# EAGLE design Sicaklik_Kontrollu_Park_Sensoru (EAGLE 9.6.2)
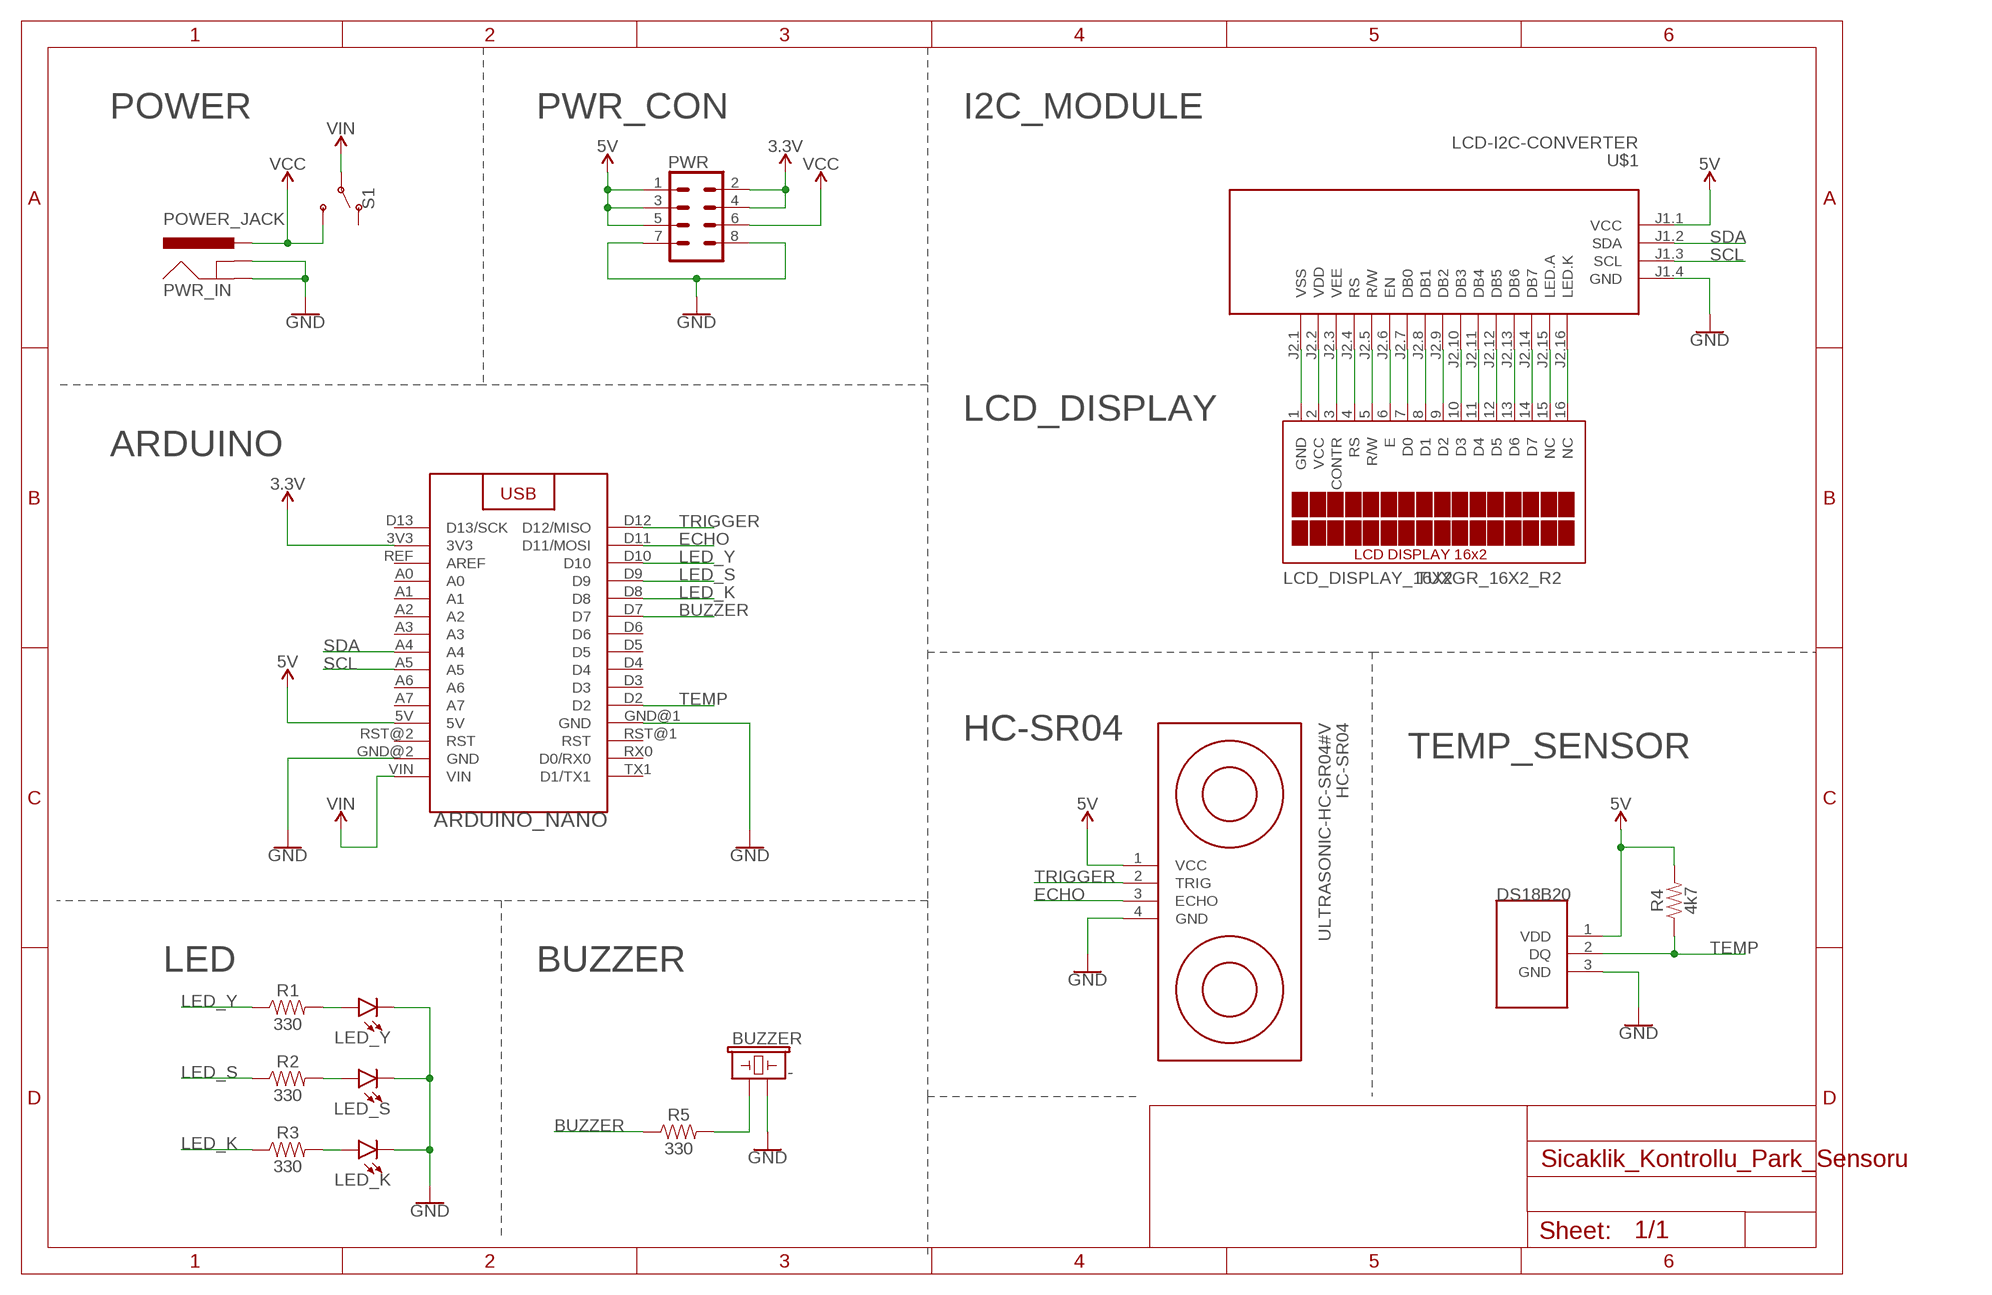
[diagram p0: schematic, sheet 1]

## Parts
ARDUINO_NANO  ARDUINO_NANO  [ARDUINO_NANO]
BUZZER  -  BUZZER-PTH  [BUZZER-12MM]
DS18B20  DS18B20  [TO-92]
HC-SR04  ULTRASONIC-HC-SR04#V  [ULTRASONIC-HC-SR04#V]
LCD_DISPLAY_16X2  TUXGR_16X2_R2  [TUXGR_16X2_R2]
LED_K  LED3MM  [LED_3MM]
LED_S  LED3MM  [LED_3MM]
LED_Y  LED3MM  [LED_3MM]
PWR  CONN_04X2  [2X4]
PWR_IN  POWER_JACK  [POWER_JACK_PTH]
R1  330  1KOHM-HORIZ-1/4W-5%  [AXIAL-0.3]
R2  330  1KOHM-HORIZ-1/4W-5%  [AXIAL-0.3]
R3  330  1KOHM-HORIZ-1/4W-5%  [AXIAL-0.3]
R4  4k7  1KOHM-HORIZ-1/4W-5%  [AXIAL-0.3]
R5  330  1KOHM-HORIZ-1/4W-5%  [AXIAL-0.3]
S1  SWITCH-SPDT-SMD-RIGHT-ANGLE  [SWITCH_SPST_SMD_A]
U$1  LCD-I2C-CONVERTER  [LCD-I2C-CONVERTER]

## Nets
3.3V: ARDUINO_NANO.3V3 PWR.2 PWR.4
5V: ARDUINO_NANO.5V DS18B20.1(VDD) HC-SR04.1(VCC) PWR.1 PWR.3 PWR.5 R4.P$2 U$1.J1.1(VCC)
BUZZER: ARDUINO_NANO.D7 R5.P$1
ECHO: ARDUINO_NANO.D11(D11/MOSI) HC-SR04.3(ECHO)
GND: ARDUINO_NANO.GND@1(GND) ARDUINO_NANO.GND@2(GND) BUZZER.- DS18B20.3(GND) HC-SR04.4(GND) LED_K.K(C) LED_S.K(C) LED_Y.K(C) PWR.7 PWR.8 PWR_IN.GND PWR_IN.GNDBREAK U$1.J1.4(GND)
LED_K: ARDUINO_NANO.D8 R3.P$1
LED_S: ARDUINO_NANO.D9 R2.P$1
LED_Y: ARDUINO_NANO.D10 R1.P$1
N$1: LCD_DISPLAY_16X2.16(NC) U$1.J2.16(LED.K)
N$2: LCD_DISPLAY_16X2.15(NC) U$1.J2.15(LED.A)
N$3: LCD_DISPLAY_16X2.14(D7) U$1.J2.14(DB7)
N$4: LCD_DISPLAY_16X2.13(D6) U$1.J2.13(DB6)
N$5: LCD_DISPLAY_16X2.12(D5) U$1.J2.12(DB5)
N$6: LCD_DISPLAY_16X2.11(D4) U$1.J2.11(DB4)
N$7: LCD_DISPLAY_16X2.10(D3) U$1.J2.10(DB3)
N$8: LCD_DISPLAY_16X2.9(D2) U$1.J2.9(DB2)
N$9: LCD_DISPLAY_16X2.8(D1) U$1.J2.8(DB1)
N$10: LCD_DISPLAY_16X2.7(D0) U$1.J2.7(DB0)
N$11: LCD_DISPLAY_16X2.6(E) U$1.J2.6(EN)
N$12: LCD_DISPLAY_16X2.5(R/W) U$1.J2.5(R/W)
N$13: LCD_DISPLAY_16X2.4(RS) U$1.J2.4(RS)
N$14: LCD_DISPLAY_16X2.3(CONTR) U$1.J2.3(VEE)
N$15: LCD_DISPLAY_16X2.2(VCC) U$1.J2.2(VDD)
N$16: LCD_DISPLAY_16X2.1(GND) U$1.J2.1(VSS)
N$18: BUZZER.+ R5.P$2
N$22: LED_Y.A R1.P$2
N$23: LED_S.A R2.P$2
N$24: LED_K.A R3.P$2
SCL: ARDUINO_NANO.A5 U$1.J1.3(SCL)
SDA: ARDUINO_NANO.A4 U$1.J1.2(SDA)
TEMP: ARDUINO_NANO.D2 DS18B20.2(DQ) R4.P$1
TRIGGER: ARDUINO_NANO.D12(D12/MISO) HC-SR04.2(TRIG)
VCC: PWR.6 PWR_IN.PWR S1.3(S)
VIN: ARDUINO_NANO.VIN S1.2(P)
Unconnected: ARDUINO_NANO.A0 ARDUINO_NANO.A1 ARDUINO_NANO.A2 ARDUINO_NANO.A3 ARDUINO_NANO.A6 ARDUINO_NANO.A7 ARDUINO_NANO.D3 ARDUINO_NANO.D4 ARDUINO_NANO.D5 ARDUINO_NANO.D6 ARDUINO_NANO.D13(D13/SCK) ARDUINO_NANO.REF(AREF) ARDUINO_NANO.RST@1(RST) ARDUINO_NANO.RST@2(RST) ARDUINO_NANO.RX0(D0/RX0) ARDUINO_NANO.TX1(D1/TX1) S1.1(O)

## Notes on the sheet
- POWER | PWR_CON | I2C_MODULE
- LCD_DISPLAY
- ARDUINO
- HC-SR04
- TEMP_SENSOR
- LED | BUZZER

## Library data of the parts
ARDUINO_NANO = Arikaya_lib:ARDUINO_NANO: Arduino Nano Devices
BUZZER = SparkFun-Electromechanical:BUZZER: Buzzer Small round buzzers that operate around the audible 2kHz range. You can use these as speakers to create simple music or user interfaces. Variant Overview: PTH - Mini Speaker - PC Mount 12mm 2.048kHz <https://www.sparkfun.com/products/7950> PTH_KIT - Mini Speaker - PC Mount 12mm 2.048kHz <https://www.sparkfun.com/products/7950> KIT simplifies soldering by adding stop mask to one side of the pads. PTH_NO_SILK - Mini Speaker - PC Mount 12mm 2.048kHz <https://www.sparkfun.com/products/7950> No silkscreen indicator of buzzer outline. PTH_KIT_NO_SILK - Mini Speaker - PC Mount 12mm 2.048kHz <https://www.sparkfun.com/products/7950> KIT package w/o silkscreen SMD - Buzzer Audio Magnetic (CCV-084B16) SMD buzzer used on, e.g. the LilyPad Buzzer <https://www.sparkfun.com/products/8463> and RFID USB Reader <https://www.sparkfun.com/products/9963>. SMD_KIT - Buzzer Audio Magnetic (CCV-084B16) SMD Buzzer with elongated pins to make soldering easier. Used on the SparkFun Simon Says - Surface Mount Soldering Kit <https://www.sparkfun.com/products/10935>.; PROD_ID: COMP-08253; SF_SKU: COM-07950
DS18B20 = Arikaya_lib:DS18B20
HC-SR04 = diy-modules:ULTRASONIC-HC-SR04: Ultrasonic Ranging Module HC-SR04 More details available here: http://randomnerdtutorials.com/complete-guide-for-ultrasonic-sensor-hc-sr04/ Click here to find device on ebay.com <http://www.ebay.com/sch/hc+sr04+ultrasonic>
LCD_DISPLAY_16X2 = display-lcd:TUXGR_16X2_R2: Tuxgraphics LCD display 16x2 characters reflective, without background light Source: tuxgr_12x2_r2.pdf; OC_FARNELL: unknown; OC_NEWARK: unknown
LED_K LED_S LED_Y = SparkFun-LED:LED: LED (Generic) Standard schematic elements and footprints for 5mm, 3mm, 1206, and 0603 sized LEDs. Generic LEDs with no color specified.; PROD_ID: DIO-08794
PWR = SparkFun-Connectors:CONN_04X2: Multi connection point. Often used as Generic Header-pin footprint for 0.1 inch spaced/style header connections On any of the 0.1 inch spaced packages, you can populate with these: Break Away Headers - Straight <https://www.sparkfun.com/products/116> (PRT-00116) Break Away Male Headers - Right Angle <https://www.sparkfun.com/products/553> (PRT-00553) Female Headers <https://www.sparkfun.com/products/115> (PRT-00115) Break Away Headers - Machine Pin <https://www.sparkfun.com/products/117> (PRT-00117) Break Away Female Headers - Swiss Machine Pin <https://www.sparkfun.com/products/743> (PRT-00743)
PWR_IN = SparkFun-Connectors:POWER_JACK: Power Jack Connector This is the standard 5.5mm barrel jack for power. The PTH is the most common, proven, reliable, footprint. The Slot footprint only works if the mill layer is transmitted to the PCB fab house so be warned. Here are the connectors we sell at SparkFun: DC Barrel Power Jack/Connector <https://www.sparkfun.com/products/119> (PRT-00119) DC Barrel Power Jack/Connector (SMD) <https://www.sparkfun.com/products/12748> (PRT-12748) DC Barrel Jack Adapter - Breadboard Compatible <https://www.sparkfun.com/products/10811> (PRT-10811) It is used on this SparkFun product (and many, many others): SparkFun RedBoard - Programmed with Arduino <https://www.sparkfun.com/products/12757> (DEV-12757) Also, if you need a mating power supply or connector, please check these out: Wall Adapter Power Supply - 9VDC 650mA <https://www.sparkfun.com/products/298> (TOL-00298) DC Barrel Jack Adapter - Male <https://www.sparkfun.com/products/10287> (PRT-10287); PROD_ID: CONN-08197
R1-R5 = SparkFun-Resistors:1KOHM: 1kΩ resistor A resistor is a passive two-terminal electrical component that implements electrical resistance as a circuit element. Resistors act to reduce current flow, and, at the same time, act to lower voltage levels within circuits. - Wikipedia; PROD_ID: RES-08380; VALUE: 1k
S1 = SparkFun-Switches:SWITCH-SPDT: Single Pole, Double Throw (SPDT) Switch Single-pole, double-throw (SPDT) switch. Variant Overview SMD-AYZ0202 Surface Mount DPDT Switch <https://www.sparkfun.com/products/597> (COM-00597) Used on e.g. LilyPad Arduino USB - ATmega32U4 Board <https://www.sparkfun.com/products/12049> PTH-11.6X4.0MM SPDT Mini Power Switch <https://www.sparkfun.com/products/102> (COM-00102) Used on e.g. SparkFun Simon Says - Through-Hole Soldering Kit <https://www.sparkfun.com/products/10547> (KIT-10547) PTH-11.6X4.0MM-KIT KIT version of SPDT Mini Power Switch - Simplifies soldering by removing tStop of switch pins - only one side can be soldered. PTH-11.6X4.0MM-LOCK LOCK version of SPDT Mini Power Switch - Offset pins hold switch in place for easier soldering. SMD-RIGHT-ANGLE Surface Mount Right Angle Switch <https://www.sparkfun.com/products/10860> (COM-10860) Used on e.g. SparkFun ESP8266 Thing <https://www.sparkfun.com/products/13231>; PROD_ID: SWCH-10651; SF_SKU: COM-10860
U$1 = diy-modules:LCD-I2C-CONVERTER: I2C Bus to 4-Bit Parallel LCD Interface with LED backlight driver

## Board
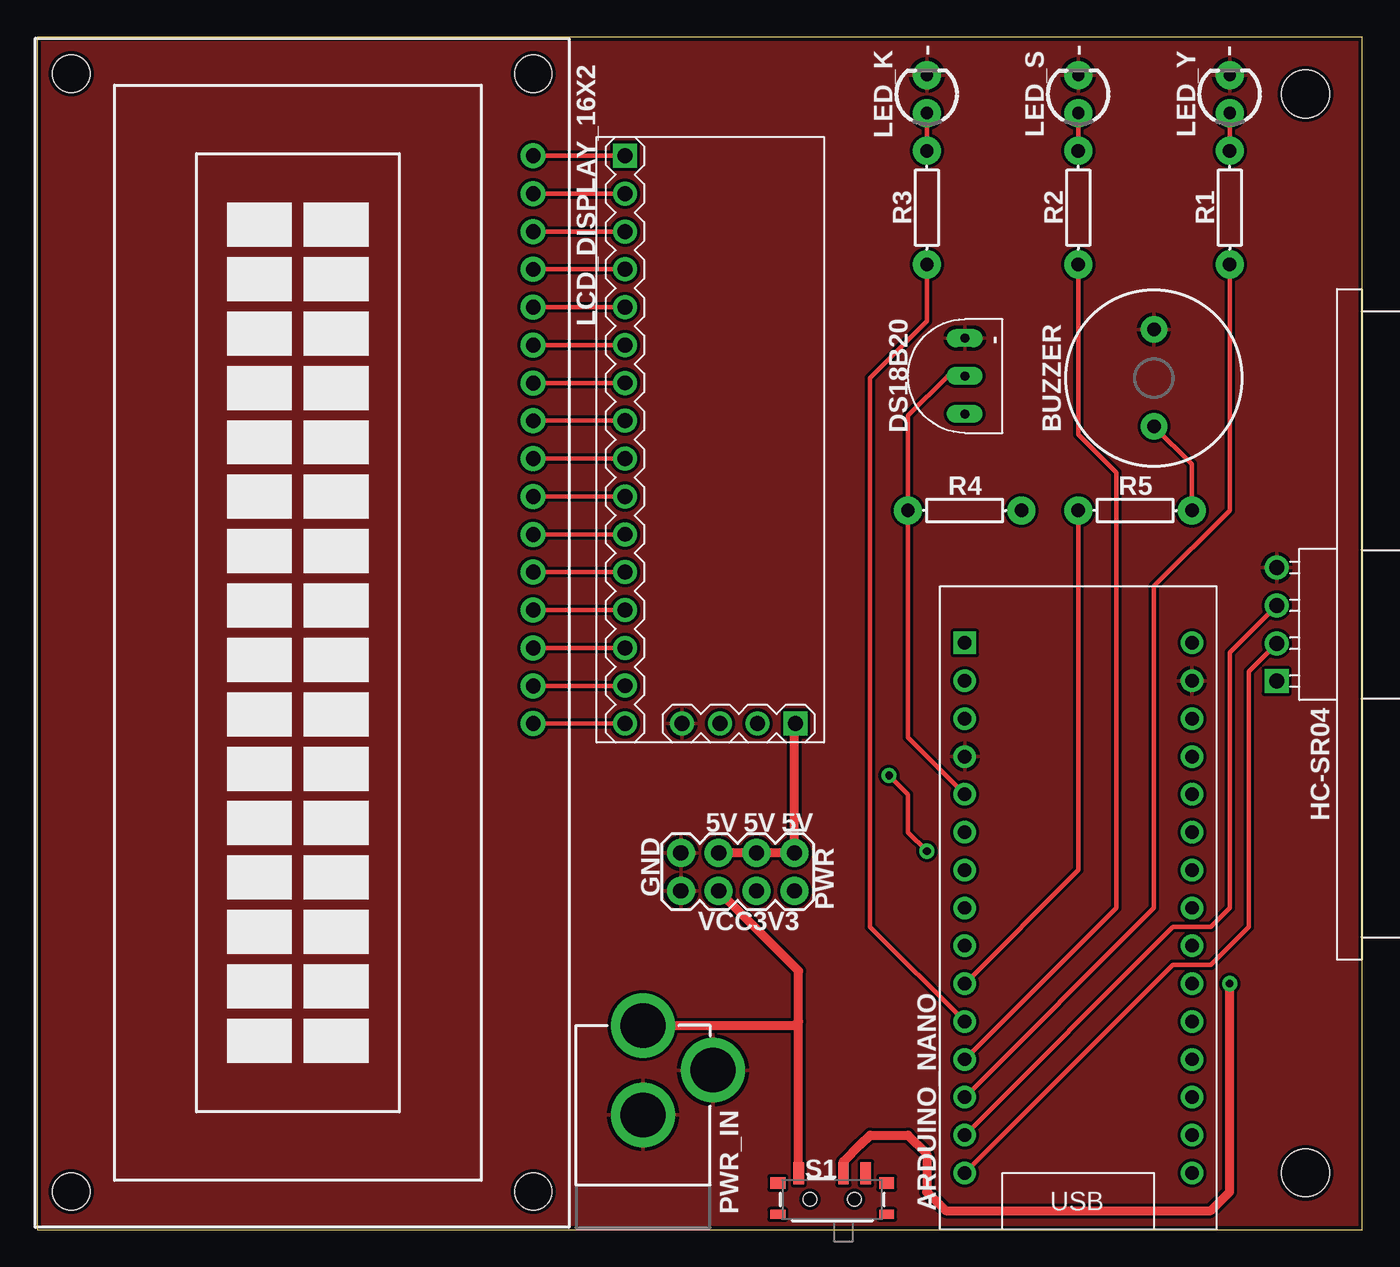
[diagram p1: board, top side]
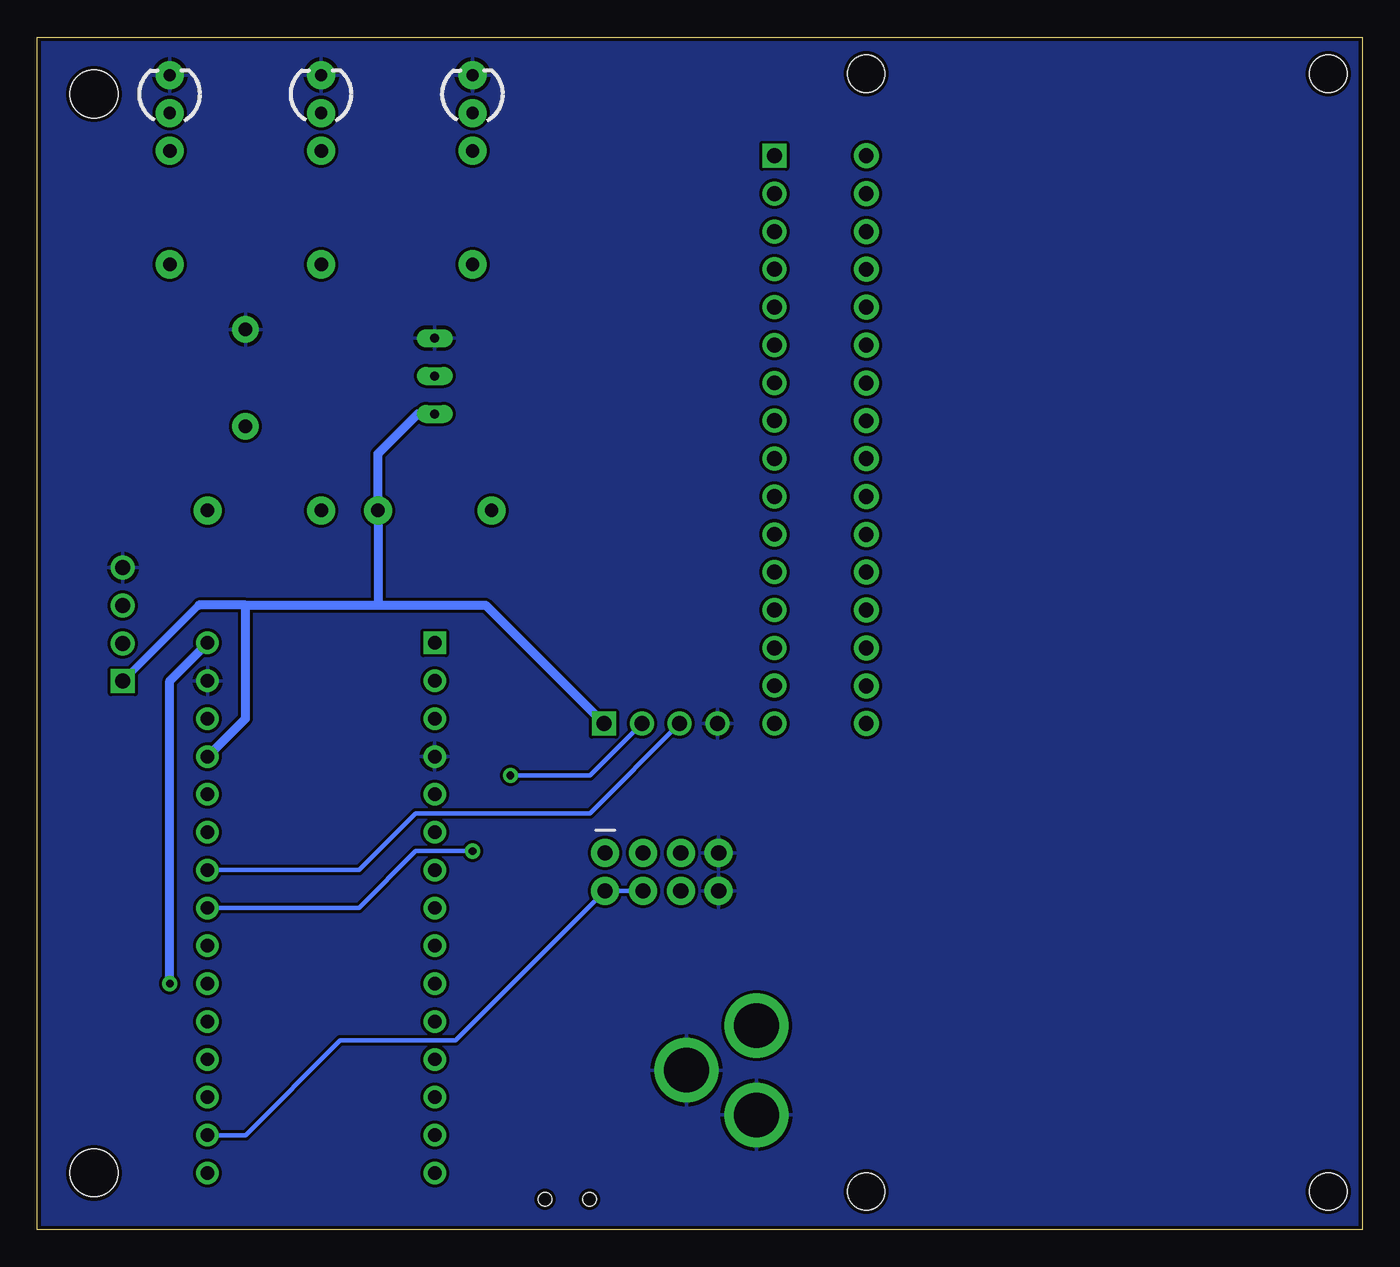
[diagram p2: board, bottom side, seen from below]

Size 88.9 x 80.01 mm. Coordinates in mm from the lower left corner, seen from the top.
Outline: 0,0 88.9,0 88.9,80.01 0,80.01 0,0
Copper layers (1*16): Top 0.035mm / dielectric 1.5mm / Bottom 0.035mm
Design rules "SparkFun": minimum track width 8mil, minimum drill 20mil, track to track 8mil, track to pad 8mil, pad to pad 8mil, via to via 8mil, smd to smd 8mil, copper to edge 10mil, drill to drill 8mil, minimum pad ring 12mil, minimum via ring 10mil, stop-mask expansion 4mil, vias tented up to drill 25mil, thermal gap 10mil
Holes 3.2 mm at 85.09,3.81 85.09,76.2

### Footprints (pad centres in the part's own frame; a part is rotated, then mirrored left to right if it is on the bottom)
ARDUINO_NANO = drill 0.9: 3V3 7.62,-15.24; 5V 7.62,10.16; A0 7.62,-10.16; A1 7.62,-7.62; A2 7.62,-5.08; A3 7.62,-2.54; A4 7.62,0; A5 7.62,2.54; A6 7.62,5.08; A7 7.62,7.62; D2 -7.62,7.62; D3 -7.62,5.08; D4 -7.62,2.54; D5 -7.62,0; D6 -7.62,-2.54; D7 -7.62,-5.08; D8 -7.62,-7.62; D9 -7.62,-10.16; D10 -7.62,-12.7; D11 -7.62,-15.24; D12 -7.62,-17.78; D13 7.62,-17.78; GND@1 -7.62,10.16; GND@2 7.62,15.24; REF 7.62,-12.7; RST@1 -7.62,12.7; RST@2 7.62,12.7; RX0 -7.62,15.24; VIN 7.62,17.78 | drill 0.9 square: TX1 -7.62,17.78
BUZZER-12MM = drill 0.9 pad 1.778: + 3.25,0; - -3.25,0
TO-92 = drill 0.6 long: 1 -2.54,0; 2 0,0; 3 2.54,0
ULTRASONIC-HC-SR04#V = drill 1 square: 1 -3.81,0 | drill 1: 2 -1.27,0; 3 1.27,0; 4 3.81,0
TUXGR_16X2_R2 = drill 1 pad 1.676: 1 -32,15.5; 2 -29.46,15.5; 3 -26.92,15.5; 4 -24.38,15.5; 5 -21.84,15.5; 6 -19.3,15.5; 7 -16.76,15.5; 8 -14.22,15.5; 9 -11.68,15.5; 10 -9.14,15.5; 11 -6.6,15.5; 12 -4.06,15.5; 13 -1.52,15.5; 14 1.02,15.5; 15 3.56,15.5; 16 6.1,15.5 | hole 2.5: -37.5,-15.5; 37.5,-15.5; -37.5,15.5; 37.5,15.5
LED_3MM = drill 0.813 pad 1.88: A -1.27,0; K 1.27,0
2X4 = drill 1.016 pad 1.88: 1 -3.81,-1.27; 2 -3.81,1.27; 3 -1.27,-1.27; 4 -1.27,1.27; 5 1.27,-1.27; 6 1.27,1.27; 7 3.81,-1.27; 8 3.81,1.27
POWER_JACK_PTH = drill 2.997 pad 4.318: GND 0,7.7; GNDBREAK 4.7,10.7; PWR 0,13.7
AXIAL-0.3 = drill 0.9 pad 1.88: P$1 -3.81,0; P$2 3.81,0
SWITCH_SPST_SMD_A = smd 0.7 x 1.5: 1 -2.25,-1.75; 2 -0.75,-1.75; 3 2.25,-1.75 | smd 1 x 0.6: GND1 -3.65,1; GND3 3.65,1 | smd 1 x 0.8: GND2 -3.65,-1.1; GND4 3.65,-1.1 | hole 0.9: -1.5,0; 1.5,0
LCD-I2C-CONVERTER = drill 1 square: J1.1 -19.05,-5.08; J2.1 19.05,6.35 | drill 1: J1.2 -19.05,-2.54; J1.3 -19.05,0; J1.4 -19.05,2.54; J2.2 16.51,6.35; J2.3 13.97,6.35; J2.4 11.43,6.35; J2.5 8.89,6.35; J2.6 6.35,6.35; J2.7 3.81,6.35; J2.8 1.27,6.35; J2.9 -1.27,6.35; J2.10 -3.81,6.35; J2.11 -6.35,6.35; J2.12 -8.89,6.35; J2.13 -11.43,6.35; J2.14 -13.97,6.35; J2.15 -16.51,6.35; J2.16 -19.05,6.35

### Placement (x,y rotation side)
ARDUINO_NANO  69.85,21.59 0 top
BUZZER  74.93,57.15 270 top
DS18B20  62.23,57.28 90 top
HC-SR04  83.16,40.61 90 top
LCD_DISPLAY_16X2  17.78,40.06 270 top
LED_K  59.69,76.2 90 top
LED_S  69.85,76.2 90 top
LED_Y  80.01,76.2 90 top
PWR  46.99,24 180 top
PWR_IN  40.64,0 0 top
R1  80.01,68.58 90 top
R2  69.85,68.58 90 top
R3  59.69,68.58 90 top
R4  62.23,48.26 0 top
R5  73.66,48.26 0 top
S1  53.34,2.03 180 top
U$1  45.8,53.01 90 top

### Tracks (layer width: path | path; a pad name or v marks a point on that pad's centre or on a via)
3.3V
  Bottom 0.305: ARDUINO_NANO.3V3 74.93,6.35 68.58,12.7 60.83,12.7 PWR.2 PWR.4
5V
  Top 0.61: U$1.J1.1 50.8,33.88 PWR.1 PWR.3 PWR.5
  Bottom 0.508: 78.05,41.91 HC-SR04.1
  Bottom 0.61: ARDUINO_NANO.5V 74.93,34.29 74.93,41.91 | 74.93,41.91 78.05,41.91 | 74.93,41.91 66.04,41.91 | U$1.J1.1 58.83,41.91 66.04,41.91 | 66.04,41.91 R4.P$2 66.04,52.07 63.37,54.74 DS18B20.1
BUZZER
  Top 0.305: R5.P$1 69.85,24.13 ARDUINO_NANO.D7
ECHO
  Top 0.305: ARDUINO_NANO.D11 76.2,20.32 78.74,20.32 80.01,21.59 80.01,38.73 HC-SR04.3
GND
  pour Top: -2.54,82.55 -2.54,-2.54 91.44,-2.54 91.44,82.55
  pour Bottom: -5.08,85.09 -5.08,-5.08 93.98,-5.08 93.98,85.09
LED_K
  Top 0.305: R3.P$1 59.69,60.96 55.88,57.15 55.88,20.32 ARDUINO_NANO.D8
LED_S
  Top 0.305: R2.P$1 69.85,53.34 72.39,50.8 72.39,21.59 ARDUINO_NANO.D9
LED_Y
  Top 0.305: R1.P$1 80.01,48.26 74.93,43.18 74.93,21.59 ARDUINO_NANO.D10
N$1
  Top 0.305: LCD_DISPLAY_16X2.16 U$1.J2.16
N$2
  Top 0.305: LCD_DISPLAY_16X2.15 U$1.J2.15
N$3
  Top 0.305: LCD_DISPLAY_16X2.14 U$1.J2.14
N$4
  Top 0.305: LCD_DISPLAY_16X2.13 U$1.J2.13
N$5
  Top 0.305: LCD_DISPLAY_16X2.12 U$1.J2.12
N$6
  Top 0.305: LCD_DISPLAY_16X2.11 U$1.J2.11
N$7
  Top 0.305: LCD_DISPLAY_16X2.10 U$1.J2.10
N$8
  Top 0.305: LCD_DISPLAY_16X2.9 U$1.J2.9
N$9
  Top 0.305: LCD_DISPLAY_16X2.8 U$1.J2.8
N$10
  Top 0.305: LCD_DISPLAY_16X2.7 U$1.J2.7
N$11
  Top 0.305: LCD_DISPLAY_16X2.6 U$1.J2.6
N$12
  Top 0.305: LCD_DISPLAY_16X2.5 U$1.J2.5
N$13
  Top 0.305: LCD_DISPLAY_16X2.4 U$1.J2.4
N$14
  Top 0.305: LCD_DISPLAY_16X2.3 U$1.J2.3
N$15
  Top 0.305: LCD_DISPLAY_16X2.2 U$1.J2.2
N$16
  Top 0.305: LCD_DISPLAY_16X2.1 U$1.J2.1
N$18
  Top 0.305: R5.P$2 77.47,51.36 BUZZER.+
N$22
  Top 0.305: R1.P$2 LED_Y.A
N$23
  Top 0.305: R2.P$2 LED_S.A
N$24
  Top 0.305: R3.P$2 LED_K.A
SCL
  Bottom 0.305: ARDUINO_NANO.A5 67.31,24.13 63.5,27.94 51.82,27.94 U$1.J1.3
SDA  (via drill 0.51)
  Top 0.305: v59.69,25.4 58.42,26.67 58.42,29.21 v57.15,30.48
  Bottom 0.305: ARDUINO_NANO.A4 67.31,21.59 63.5,25.4 v59.69,25.4 | v57.15,30.48 51.82,30.48 U$1.J1.2
TEMP
  Top 0.305: DS18B20.2 61.09,57.28 58.42,54.61 R4.P$1 58.42,33.02 ARDUINO_NANO.D2
TRIGGER
  Top 0.305: ARDUINO_NANO.D12 76.2,17.78 78.74,17.78 81.28,20.32 81.28,37.47 HC-SR04.2
VCC
  Top 0.61: S1.3 51.09,13.97 | 51.09,13.97 51.09,17.36 PWR.6 | PWR_IN.PWR 50.82,13.7 51.09,13.97
VIN  (via drill 0.51)
  Top 0.508: S1.2 54.09,4.56
  Top 0.61: 54.09,4.56 55.24,5.71 55.88,6.35 58.42,6.35 59.69,5.08 59.69,2.54 60.96,1.27 78.74,1.27 80.01,2.54 v80.01,16.51
  Bottom 0.61: v80.01,16.51 80.01,36.83 ARDUINO_NANO.VIN

### Text on the board
tPlace: - | - | -
tNames: - | 5V | 5V | 5V | GND | VCC | 3V3